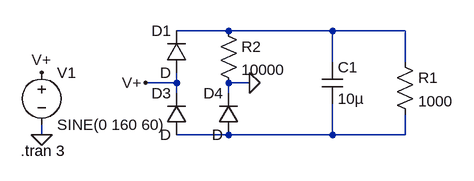
[diagram p0: schematic FBR.asc]
FBR.asc, the LTspice schematic file:
Version 4
SHEET 1 880 680
WIRE 304 80 224 80
WIRE 464 80 304 80
WIRE 576 80 464 80
WIRE 464 128 464 80
WIRE 576 128 576 80
WIRE 224 160 224 144
WIRE 224 160 176 160
WIRE 336 160 304 160
WIRE 224 176 224 160
WIRE 304 176 304 160
WIRE 16 240 16 224
WIRE 304 240 224 240
WIRE 464 240 464 192
WIRE 464 240 304 240
WIRE 576 240 576 208
WIRE 576 240 464 240
FLAG 16 144 V+
FLAG 176 160 V+
FLAG 16 240 0
FLAG 336 160 0
SYMBOL diode 240 144 R180
WINDOW 0 24 64 Left 2
WINDOW 3 24 0 Left 2
SYMATTR InstName D1
SYMBOL diode 240 240 R180
WINDOW 0 24 64 Left 2
WINDOW 3 24 0 Left 2
SYMATTR InstName D3
SYMBOL diode 320 240 R180
WINDOW 0 24 64 Left 2
WINDOW 3 24 0 Left 2
SYMATTR InstName D4
SYMBOL voltage 16 128 R0
WINDOW 123 0 0 Left 0
WINDOW 39 0 0 Left 0
SYMATTR InstName V1
SYMATTR Value SINE(0 160 60)
SYMBOL res 560 112 R0
SYMATTR InstName R1
SYMATTR Value 1000
SYMBOL cap 448 128 R0
SYMATTR InstName C1
SYMATTR Value 10µ
SYMBOL res 288 64 R0
SYMATTR InstName R2
SYMATTR Value 10000
TEXT -16 264 Left 2 !.tran 3

The netlist it stands for:
* FBR.asc
D1 V+ N001 D
D3 N002 V+ D
D4 N002 0 D
V1 V+ 0 SINE(0 160 60)
R1 N001 N002 1000
C1 N001 N002 10µ
R2 N001 0 10000
.model D D
.lib standard.dio
.tran 3
.backanno
.end